# Altium schematic sheet esp32.SchDoc
size A; SheetNumber: 8; SheetTotal: 9
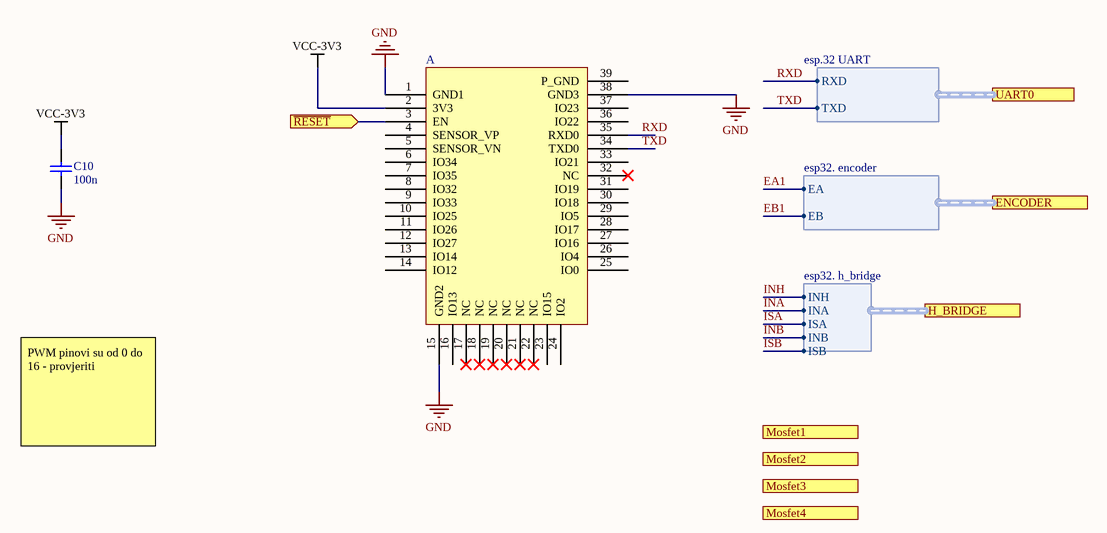
[diagram p0: esp32.SchDoc]

## Parts
?  (no value)  (part A of 3)
C10  value 100n  [RAD-0.3]

## Ports
ENCODER (harness esp32. encoder), H_BRIDGE (harness esp32. h_bridge), Mosfet1, Mosfet2, Mosfet3, Mosfet4, UART0 (harness esp.32 UART), ~{RESET} (in)

## Harnesses
esp.32 UART: RXD, TXD
esp32. encoder: EA, EB
esp32. h_bridge: INH, INA, ISA, INB, ISB

## Nets
GND: ?.1(GND1) ?.15(GND2) ?.38(GND3) C10.1
VCC-3V3: ?.2(3V3) C10.2
EA1: port ENCODER.EA
EB1: port ENCODER.EB
INA: port H_BRIDGE.INA
INB: port H_BRIDGE.INB
INH: port H_BRIDGE.INH
ISA: port H_BRIDGE.ISA
ISB: port H_BRIDGE.ISB
~{RESET}: ?.3(EN) ; port ~{RESET}
RXD: ?.35(RXD0) ; port UART0.RXD
TXD: ?.34(TXD0) ; port UART0.TXD

Not connected (* = marked no-connect by the designer): ? 4(SENSOR_VP) 5(SENSOR_VN) 6(IO34) 7(IO35) 8(IO32) 9(IO33) 10(IO25) 11(IO26) 12(IO27) 13(IO14) 14(IO12) 16(IO13) 17(NC)* 18(NC)* 19(NC)* 20(NC)* 21(NC)* 22(NC)* 23(IO15) 24(IO2) 25(IO0) 26(IO4) 27(IO16) 28(IO17) 29(IO5) 30(IO18) 31(IO19) 32(NC)* 33(IO21) 36(IO22) 37(IO23) 39(P_GND)

## Notes on the sheet
- PWM pinovi su od 0 do 16 - provjeriti

## Library data of the parts
? = Component_1
C10 = Cap: Capacitor; Published: 8-Jun-2000; LatestRevisionDate: 17-Jul-2002; LatestRevisionNote: Re-released for DXP Platform.; PackageReference: RAD-0.3; Publisher: Altium Limited; PackageDescription: Radial Cap, Thru-Hole; 2 Leads; 0.3 in Pin Spacing